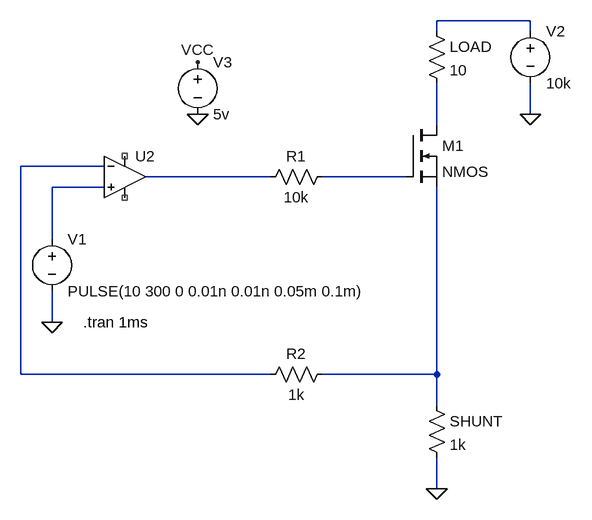
[diagram p0: schematic 6432154921-PB4.asc]
6432154921-PB4.asc, the LTspice schematic file:
Version 4
SHEET 1 1348 836
WIRE 1104 -64 960 -64
WIRE 960 -48 960 -64
WIRE 1104 -48 1104 -64
WIRE 1104 80 1104 32
WIRE 960 96 960 32
WIRE 448 160 320 160
WIRE 704 176 512 176
WIRE 912 176 784 176
WIRE 448 192 368 192
WIRE 368 272 368 192
WIRE 368 400 368 352
WIRE 320 480 320 160
WIRE 704 480 320 480
WIRE 960 480 960 192
WIRE 960 480 784 480
WIRE 960 528 960 480
WIRE 960 656 960 608
FLAG 368 400 0
FLAG 960 656 0
FLAG 1104 80 0
FLAG 592 0 VCC
FLAG 592 80 0
SYMBOL res 800 160 R90
WINDOW 0 0 56 VBottom 2
WINDOW 3 32 56 VTop 2
SYMATTR InstName R1
SYMATTR Value 10k
SYMBOL res 800 464 R90
WINDOW 0 0 56 VBottom 2
WINDOW 3 32 56 VTop 2
SYMATTR InstName R2
SYMATTR Value 1k
SYMBOL voltage 368 256 R0
WINDOW 123 0 0 Left 0
WINDOW 39 0 0 Left 0
SYMATTR InstName V1
SYMATTR Value PULSE(10 300 0 0.01n 0.01n 0.05m 0.1m)
SYMBOL res 944 512 R0
SYMATTR InstName SHUNT
SYMATTR Value 1k
SYMBOL voltage 1104 -64 R0
WINDOW 123 0 0 Left 0
WINDOW 39 0 0 Left 0
SYMATTR InstName V2
SYMATTR Value 10k
SYMBOL nmos 912 96 R0
SYMATTR InstName M1
SYMBOL res 944 -64 R0
SYMATTR InstName LOAD
SYMATTR Value 10
SYMBOL voltage 592 -16 R0
WINDOW 123 0 0 Left 0
WINDOW 39 0 0 Left 0
SYMATTR InstName V3
SYMATTR Value 5v
SYMBOL OpAmps\\UniversalOpAmp 480 176 R0
SYMATTR InstName U2
TEXT 416 400 Left 2 !.tran 1ms

The netlist it stands for:
* 6432154921-PB4.asc
R1 N005 N004 10k
R2 N007 N003 1k
V1 N006 0 PULSE(10 300 0 0.01n 0.01n 0.05m 0.1m)
R§SHUNT N007 0 1k
V2 N001 0 10k
M1 N002 N005 N007 N007 NMOS
R§LOAD N001 N002 10
V3 VCC 0 5v
XU2 N006 N003 NC_01 NC_02 N004 level1 Avol=1Meg GBW=10Meg Vos=0 En=0 Enk=0 In=0 Ink=0 Rin=500Meg  ; pins In+ In- V+ V- OUT
.model NMOS NMOS
.model PMOS PMOS
.lib standard.mos
.tran 1ms
.lib UniversalOpAmp1.lib
.backanno
.end